# EAGLE board PCB2022-20-02 (EAGLE 9.6.2)
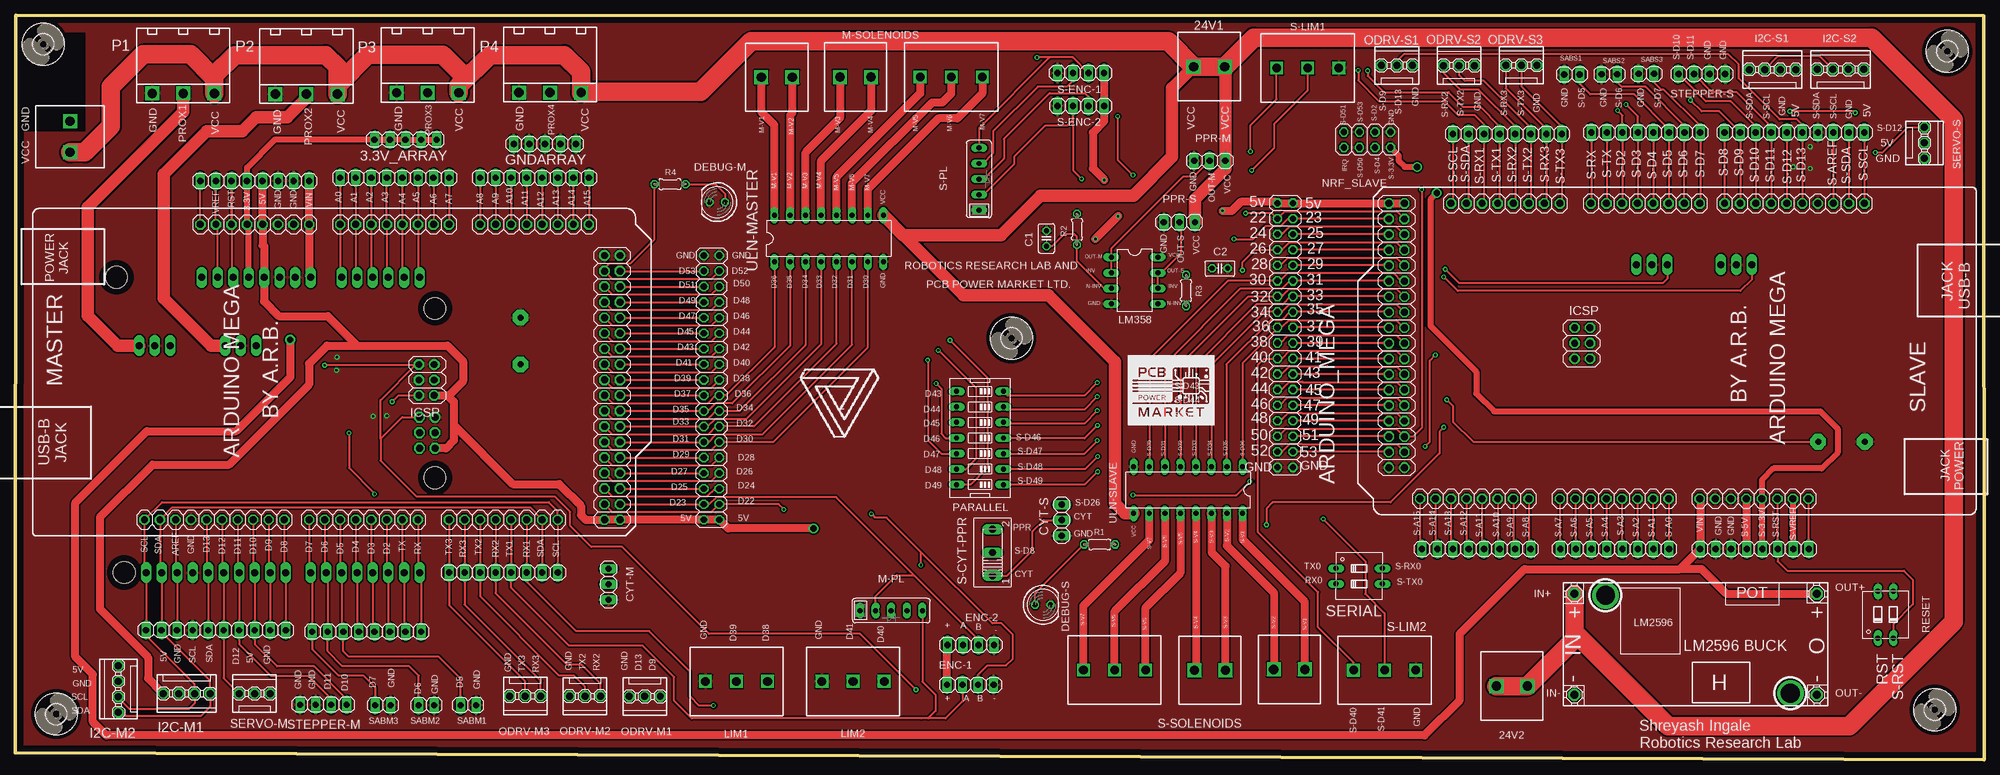
[diagram p5: board, top side]
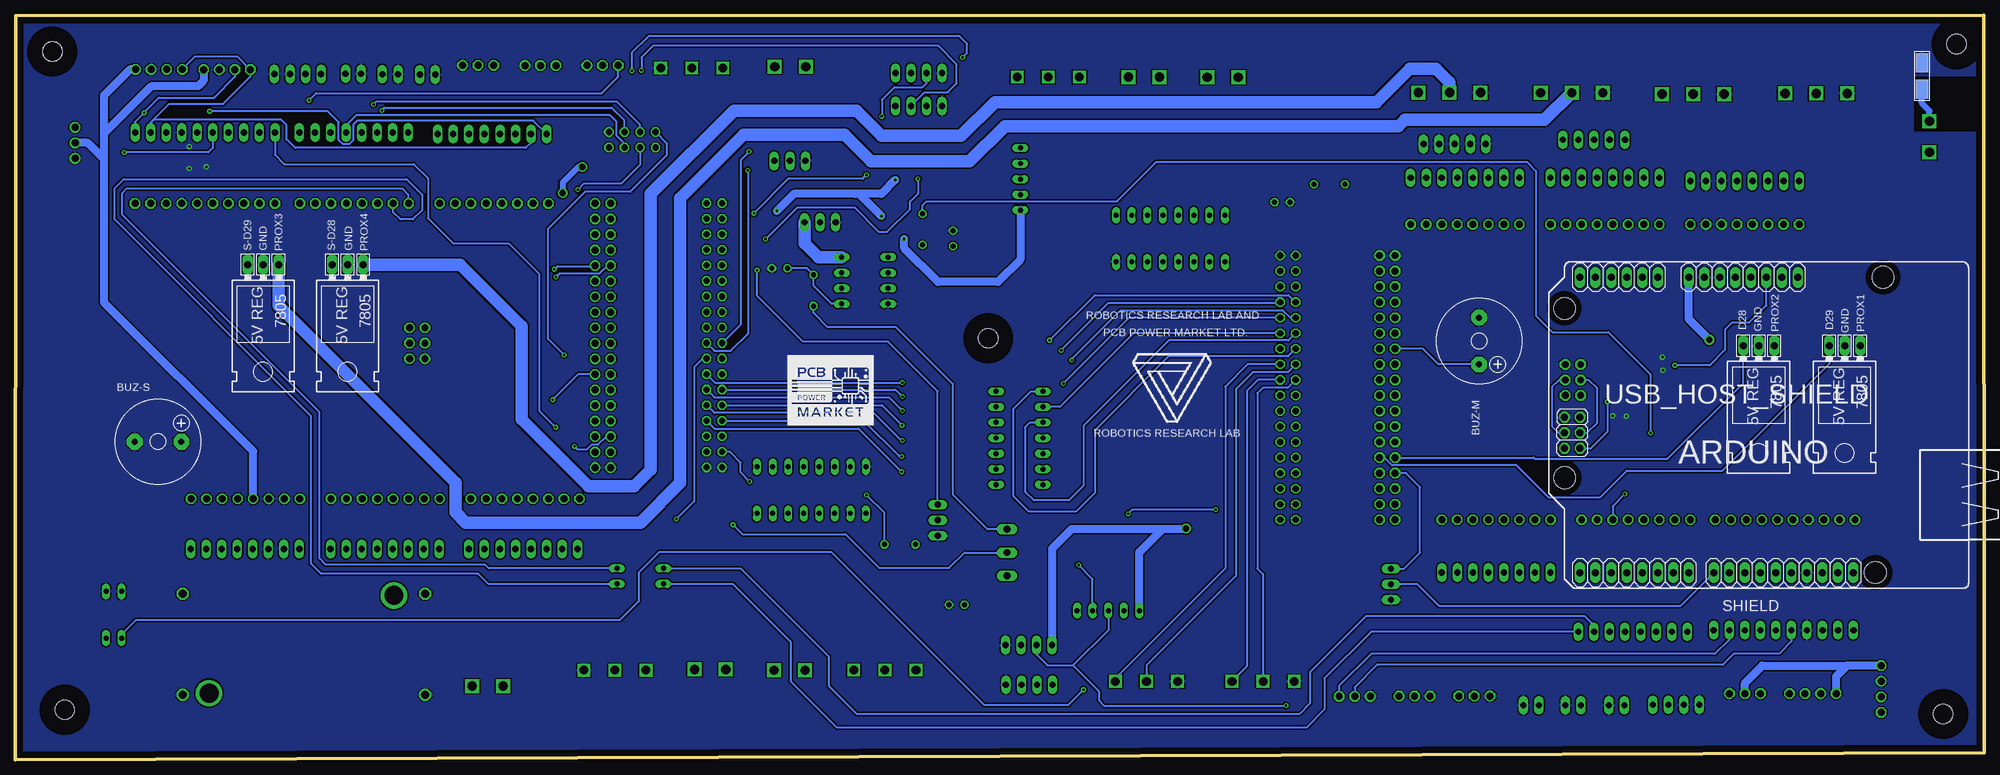
[diagram p6: board, bottom side, seen from below]

Size 321.83 x 121.63 mm. Coordinates in mm from the lower left corner, seen from the top.
Outline: 0,1.08 321.83,0 321.76,121.51 0.05,121.63 0,1.08
Copper layers (1*16): Top 0.035mm / dielectric 1.5mm / Bottom 0.035mm
Design rules "default": minimum track width 6mil, minimum drill 0.35mm, track to track 6mil, track to pad 6mil, pad to pad 6mil, via to via 6mil, smd to smd 6mil, copper to edge 40mil, drill to drill 6mil, minimum pad ring 10mil, minimum via ring 8mil, stop-mask expansion 4mil, vias tented up to drill 0mil, thermal gap 10mil
Net classes: 0 default: width 0.305 mm, drill 0.33 mm, clearance 0.203 mm; 1 arduino master: width 0.305 mm, drill 0.356 mm, clearance 0.254 mm; 2 arduino slave: width 0.305 mm, drill 0.356 mm, clearance 0.254 mm; 3 supply: width 0.305 mm, drill 0.356 mm, clearance 0.254 mm; 4 vin: width 1.016 mm, drill 0.356 mm, clearance 0.305 mm

## Footprints (pad centres in the part's own frame; a part is rotated, then mirrored left to right if it is on the bottom)
1X05 = drill 1.016 long: 1 -5.08,0; 2 -2.54,0; 3 0,0; 4 2.54,0; 5 5.08,0
AB_SCREW_TERMINAL_5MM_2PIN = drill 1.524 square: 1 0,2.54; 2 0,-2.54
F/CM12P = drill 1.016 pad 2.54 octagon: + 3.81,0; - -3.81,0
C025-025X050 = drill 0.813 octagon: 1 -1.27,0; 2 1.27,0
1X03 = drill 1.016 long: 1 -2.54,0; 2 0,0; 3 2.54,0
LED5MM = drill 0.813 octagon: A -1.27,0; K 1.27,0
1X04 = drill 1.016 long: 1 -3.81,0; 2 -1.27,0; 3 1.27,0; 4 3.81,0
3,2 = hole 3.2: 0,0
4PIN_RELIMATE_CONNECTOR = drill 1.143 octagon: 1 0,-3.81; 2 0,-1.27; 3 0,1.27; 4 0,3.81
AB_SCREW_TER_5MM_3PIN = drill 1.397 square: 1 2.54,5.08; 2 2.54,0; 3 2.54,-5.08
DIL08 = drill 0.813 long: 1 -3.81,-3.81; 2 -1.27,-3.81; 3 1.27,-3.81; 4 3.81,-3.81; 5 3.81,3.81; 6 1.27,3.81; 7 -1.27,3.81; 8 -3.81,3.81
1X08 = drill 1.016 long: 1 -8.89,0; 2 -6.35,0; 3 -3.81,0; 4 -1.27,0; 5 1.27,0; 6 3.81,0; 7 6.35,0; 8 8.89,0
1X10 = drill 1.016 long: 1 -11.43,0; 2 -8.89,0; 3 -6.35,0; 4 -3.81,0; 5 -1.27,0; 6 1.27,0; 7 3.81,0; 8 6.35,0; 9 8.89,0; 10 11.43,0
2X18 = drill 1.016 octagon: 1 -21.59,-1.27; 2 -21.59,1.27; 3 -19.05,-1.27; 4 -19.05,1.27; 5 -16.51,-1.27; 6 -16.51,1.27; 7 -13.97,-1.27; 8 -13.97,1.27; 9 -11.43,-1.27; 10 -11.43,1.27; 11 -8.89,-1.27; 12 -8.89,1.27; 13 -6.35,-1.27; 14 -6.35,1.27; 15 -3.81,-1.27; 16 -3.81,1.27; 17 -1.27,-1.27; 18 -1.27,1.27; 19 1.27,-1.27; 20 1.27,1.27; 21 3.81,-1.27; 22 3.81,1.27; 23 6.35,-1.27; 24 6.35,1.27; 25 8.89,-1.27; 26 8.89,1.27; 27 11.43,-1.27; 28 11.43,1.27; 29 13.97,-1.27; 30 13.97,1.27; 31 16.51,-1.27; 32 16.51,1.27; 33 19.05,-1.27; 34 19.05,1.27; 35 21.59,-1.27; 36 21.59,1.27
SIL05A = drill 0.813 long: 1 -5.08,0; 2 -2.54,0; 3 0,0; 4 2.54,0; 5 5.08,0
ARDUINO_MEGA = drill 1.13 octagon: 3V3 24.13,21.59; 5V 24.13,19.05; 5V1 -24.13,-36.83; 5V2 -24.13,-39.37; 5V3 -3.81,-9.017; - 24.13,29.21; A0 24.13,6.35; A1 24.13,3.81; A2 24.13,1.27; A3 24.13,-1.27; A4 24.13,-3.81; A5 24.13,-6.35; A6 24.13,-8.89; A7 24.13,-11.43; A8 24.13,-16.51; A9 24.13,-19.05; A10 24.13,-21.59; A11 24.13,-24.13; A12 24.13,-26.67; A13 24.13,-29.21; A14 24.13,-31.75; A15 24.13,-34.29; AREF -24.13,33.274; D2 -24.13,-1.27; D3 -24.13,1.27; D4 -24.13,3.81; D5 -24.13,6.35; D6 -24.13,8.89; D7 -24.13,11.43; D8 -24.13,15.494; D9 -24.13,18.034; D10 -24.13,20.574; D11 -24.13,23.114; D12 -24.13,25.654; D13 -24.13,28.194; D22 -21.59,-36.83; D23 -21.59,-39.37; D24 -19.05,-36.83; D25 -19.05,-39.37; D26 -16.51,-36.83; D27 -16.51,-39.37; D28 -13.97,-36.83; D29 -13.97,-39.37; D30 -11.43,-36.83; D31 -11.43,-39.37; D32 -8.89,-36.83; D33 -8.89,-39.37; D34 -6.35,-36.83; D35 -6.35,-39.37; D36 -3.81,-36.83; D37 -3.81,-39.37; D38 -1.27,-36.83; D39 -1.27,-39.37; D40 1.27,-36.83; D41 1.27,-39.37; D42 3.81,-36.83; D43 3.81,-39.37; D44 6.35,-36.83; D45 6.35,-39.37; D46 8.89,-36.83; D47 8.89,-39.37; D48 11.43,-36.83; D49 11.43,-39.37; D50 13.97,-36.83; D51 13.97,-39.37; D52 16.51,-36.83; D53 16.51,-39.37; GD3 19.05,-36.83; GD4 19.05,-39.37; GND 24.13,13.97; GND1 24.13,16.51; GND2 -24.13,30.734; GND5 1.245,-9.017; IOREF 24.13,26.67; MISO -3.81,-6.502; MOSI -1.295,-9.017; RST 24.13,24.13; RST1 1.245,-6.502; RX0 -24.13,-6.35; RX1 -24.13,-24.13; RX2 -24.13,-19.05; RX3 -24.13,-13.97; SCK -1.295,-6.502; SCL -24.13,-29.21; SCLU -24.13,38.354; SDA -24.13,-26.67; SDAU -24.13,35.814; TX0 -24.13,-3.81; TX1 -24.13,-21.59; TX2 -24.13,-16.51; TX3 -24.13,-11.43; VIN 24.13,11.43
2X04 = drill 1.016 octagon: 1 -3.81,-1.27; 2 -3.81,1.27; 3 -1.27,-1.27; 4 -1.27,1.27; 5 1.27,-1.27; 6 1.27,1.27; 7 3.81,-1.27; 8 3.81,1.27
3PIN_RELIMATE_CONNECTOR = drill 1.143 octagon: 1 -1.524,-2.54; 2 -1.524,0; 3 -1.524,2.54
AB_RIGHT_TER_BLK_3PIN = drill 1.524 square: 1 -5.588,5.08; 2 -5.588,0; 3 -5.588,-5.08
EDG-07 = drill 0.813 long: 1 -7.62,-3.81; 2 -5.08,-3.81; 3 -2.54,-3.81; 4 0,-3.81; 5 2.54,-3.81; 6 5.08,-3.81; 7 7.62,-3.81; 8 7.62,3.81; 9 5.08,3.81; 10 2.54,3.81; 11 0,3.81; 12 -2.54,3.81; 13 -5.08,3.81; 14 -7.62,3.81
0204/5 = drill 0.813 octagon: 1 -2.54,0; 2 2.54,0
DIP02YL = drill 0.813 long: 1 -1.27,-3.81; 2 1.27,-3.81; 3 1.27,3.81; 4 -1.27,3.81
255SB = drill 1.118 long: 1 -3.81,0; 2 0,0; 3 3.81,0
1X02 = drill 1.016 long: 1 -1.27,0; 2 1.27,0
ARDUINO_USB_HOST_SHIELD = drill 1.143 long: 3V3 1.27,-24.13; 5V1 3.81,-24.13; - -6.35,-24.13; A0 16.51,-24.13; A1 19.05,-24.13; A2 21.59,-24.13; A3 24.13,-24.13; A4 26.67,-24.13; A5 29.21,-24.13; AREF -10.414,24.13; D2 24.13,24.13; D3 21.59,24.13; D4 19.05,24.13; D5 16.51,24.13; D6 13.97,24.13; D7 11.43,24.13; D8 7.366,24.13; D9 4.826,24.13; D10 2.286,24.13; D11 -0.254,24.13; D12 -2.794,24.13; D13 -5.334,24.13; GND -7.874,24.13; GND2 8.89,-24.13; GND3 6.35,-24.13; RST1 -1.27,-24.13; RX0 29.21,24.13; SCL -15.494,24.13; SDA -12.954,24.13; TX0 26.67,24.13; VIN 11.43,-24.13; VREF -3.81,-24.13 | drill 1.168 octagon: 5V 31.75,3.81; GND1 31.75,-1.27; MISO 29.21,3.81; MOSI 31.75,1.27; RST 29.21,-1.27; SCK 29.21,1.27 | hole 3.56: 31.75,-19.05; 31.75,8.636; -19.05,24.13; -20.32,-24.13
AB_JUMPER_ONE_WAY = smd 3.048 x 2.032: 1 -2.286,0; 2 2.032,0
LM2596_BUCK_CONVERTER = drill 1.27 octagon: IN+ -19.304,6.35; IN- -19.304,-10.16; OUT+ 20.32,6.35; OUT- 20.32,-10.16 | drill 3.048 pad 4.318: P$1 -14.224,6.096; P$2 16.002,-9.906
AB_7805_FLAT = drill 1.143 long: 1 -7.874,1.778; 2 -7.874,-0.762; 3 -7.874,-3.302
DIL16 = drill 0.813 long: 1 -8.89,-3.81; 2 -6.35,-3.81; 3 -3.81,-3.81; 4 -1.27,-3.81; 5 1.27,-3.81; 6 3.81,-3.81; 7 6.35,-3.81; 8 8.89,-3.81; 9 8.89,3.81; 10 6.35,3.81; 11 3.81,3.81; 12 1.27,3.81; 13 -1.27,3.81; 14 -3.81,3.81; 15 -6.35,3.81; 16 -8.89,3.81

## Placement (x,y rotation side)
3.3V_ARRAY  [1X05]  63.78,101.3 180 top
24V1  AB_SCREW_TERMINAL_5MM_2PIN  [AB_SCREW_TERMINAL_5MM_2PIN]  195.15,113.23 270 top
24V2  AB_SCREW_TERMINAL_5MM_2PIN  [AB_SCREW_TERMINAL_5MM_2PIN]  244.63,12.01 90 top
BUZ-M  F/CM12P  [F/CM12P]  82.58,68.4 270 bottom
BUZ-S  F/CM12P  [F/CM12P]  298.5,51.94 0 bottom
C1  [C025-025X050]  168.55,85.17 90 top
C2  [C025-025X050]  196.9,80.26 0 top
CYT-M  [1X03]  96.98,28.65 90 top
CYT-S  [1X03]  171.06,39.14 90 top
DEBUG-M  [LED5MM]  114.73,91.11 180 top
DEBUG-S  [LED5MM]  167.97,25.3 0 top
ENC-1  [1X04]  156.11,12.22 0 top
ENC-2  [1X04]  156.18,18.72 0 top
GNDARRAY  [1X05]  86.56,100.61 180 top
H2  MOUNT-HOLE3.2  [3,2]  6.71,7.44 0 top
H3  MOUNT-HOLE3.2  [3,2]  313.74,8.15 0 top
H4  MOUNT-HOLE3.2  [3,2]  315.77,115.72 0 top
H5  MOUNT-HOLE3.2  [3,2]  4.55,116.92 0 top
H6  MOUNT-HOLE3.2  [3,2]  162.81,68.86 0 top
I2C-M1  4PIN_RELIMATE_CONNECTOR  [4PIN_RELIMATE_CONNECTOR]  28.02,10.79 90 top
I2C-M2  4PIN_RELIMATE_CONNECTOR  [4PIN_RELIMATE_CONNECTOR]  16.84,11.53 0 top
I2C-S1  4PIN_RELIMATE_CONNECTOR  [4PIN_RELIMATE_CONNECTOR]  287.22,112.75 270 top
I2C-S2  4PIN_RELIMATE_CONNECTOR  [4PIN_RELIMATE_CONNECTOR]  298.35,112.78 270 top
LIM1  AB_SCREW_TER_5MM_3PIN  [AB_SCREW_TER_5MM_3PIN]  117.88,15.32 270 top
LIM2  AB_SCREW_TER_5MM_3PIN  [AB_SCREW_TER_5MM_3PIN]  136.93,15.32 270 top
LM358  [DIL08]  182.96,78.28 270 top
M1  [1X08]  39.14,94.56 0 top
M2  [1X08]  62,95.07 0 top
M3  [1X08]  84.86,95.07 0 top
M4  [1X10]  32.79,21.16 180 top
M5  [1X08]  57.43,20.9 0 top
M6  [1X08]  79.78,30.56 0 top
M7  [2X18]  113.82,60.78 90 top
M-PL  D5-1A  [SIL05A]  143.18,24.36 0 top
M-SOLENOID1  AB_SCREW_TERMINAL_5MM_2PIN  [AB_SCREW_TERMINAL_5MM_2PIN]  124.46,111.51 270 top
M-SOLENOID2  AB_SCREW_TERMINAL_5MM_2PIN  [AB_SCREW_TERMINAL_5MM_2PIN]  137.34,111.53 270 top
M-SOLENOIDS  AB_SCREW_TER_5MM_3PIN  [AB_SCREW_TER_5MM_3PIN]  152.98,114.07 270 top
MASTER  ARDUINO_MEGA  [ARDUINO_MEGA]  59.46,63.32 90 top
NRF_SLAVE  [2X04]  220.98,101.3 180 top
ODRV-M1  3PIN_RELIMATE_CONNECTOR  [3PIN_RELIMATE_CONNECTOR]  102.9,11.84 90 top
ODRV-M2  3PIN_RELIMATE_CONNECTOR  [3PIN_RELIMATE_CONNECTOR]  93.12,11.89 90 top
ODRV-M3  3PIN_RELIMATE_CONNECTOR  [3PIN_RELIMATE_CONNECTOR]  83.34,11.91 90 top
ODRV-S1  3PIN_RELIMATE_CONNECTOR  [3PIN_RELIMATE_CONNECTOR]  225.83,111.91 270 top
ODRV-S2  3PIN_RELIMATE_CONNECTOR  [3PIN_RELIMATE_CONNECTOR]  235.99,111.89 270 top
ODRV-S3  3PIN_RELIMATE_CONNECTOR  [3PIN_RELIMATE_CONNECTOR]  246.18,111.94 270 top
P1  AB_RIGHT_TER_BLK_3PIN  [AB_RIGHT_TER_BLK_3PIN]  27.46,114.45 90 top
P2  AB_RIGHT_TER_BLK_3PIN  [AB_RIGHT_TER_BLK_3PIN]  47.57,114.35 90 top
P3  AB_RIGHT_TER_BLK_3PIN  [AB_RIGHT_TER_BLK_3PIN]  67.41,114.55 90 top
P4  AB_RIGHT_TER_BLK_3PIN  [AB_RIGHT_TER_BLK_3PIN]  87.4,114.58 90 top
PARALLEL  [EDG-07]  157.68,52.55 90 top
PPR-M  [1X03]  195.22,97.84 0 top
PPR-S  [1X03]  190.27,87.81 180 top
R1  [0204/5]  177.24,35.15 0 top
R2  [0204/5]  173.53,86.64 90 top
R3  [0204/5]  191.36,76.66 90 top
R4  [0204/5]  107.01,94.03 180 top
RESET  [DIP02YL]  305.71,23.67 0 top
S1  [1X10]  290.81,102.49 0 top
S2  [1X08]  266.5,102.49 0 top
S3  [1X08]  243.89,102.24 0 top
S4  [2X18]  207.57,69.34 270 top
S5  [1X08]  238.81,34.42 180 top
S6  [1X08]  261.42,34.42 180 top
S7  [1X08]  284.28,34.42 180 top
S-CYT-PPR  [255SB]  159.73,33.83 90 top
S-ENC-1  [1X04]  174.14,112.19 180 top
S-ENC-2  [1X04]  174.17,106.81 180 top
S-LIM1  AB_SCREW_TER_5MM_3PIN  [AB_SCREW_TER_5MM_3PIN]  211.25,110.49 90 top
S-LIM2  AB_SCREW_TER_5MM_3PIN  [AB_SCREW_TER_5MM_3PIN]  223.82,12.06 90 top
S-PL  D5-1A  [SIL05A]  157.53,94.87 90 top
S-SOLENOID1  AB_SCREW_TERMINAL_5MM_2PIN  [AB_SCREW_TERMINAL_5MM_2PIN]  208.25,14.73 90 top
S-SOLENOID2  AB_SCREW_TERMINAL_5MM_2PIN  [AB_SCREW_TERMINAL_5MM_2PIN]  195.28,14.61 90 top
S-SOLENOIDS  AB_SCREW_TER_5MM_3PIN  [AB_SCREW_TER_5MM_3PIN]  179.68,12.09 90 top
SABM1  [1X02]  74.04,8.89 180 top
SABM2  [1X02]  67.21,8.89 180 top
SABM3  [1X02]  60.1,8.89 180 top
SABS1  [1X02]  254.43,111.94 0 top
SABS2  [1X02]  260.55,111.99 0 top
SABS3  [1X02]  266.6,112.06 0 top
SERIAL  [DIP02YL]  219.68,29.97 270 top
SERVO-M  3PIN_RELIMATE_CONNECTOR  [3PIN_RELIMATE_CONNECTOR]  39.12,9.27 270 top
SERVO-S  3PIN_RELIMATE_CONNECTOR  [3PIN_RELIMATE_CONNECTOR]  310.54,100.79 180 top
SHIELD  ARDUINO_USB_HOST_SHIELD  [ARDUINO_USB_HOST_SHIELD]  36.86,54.69 180 bottom
SLAVE  ARDUINO_MEGA  [ARDUINO_MEGA]  263.89,66.75 270 top
STEPPER-M  [1X04]  50.37,8.97 180 top
STEPPER-S  [1X04]  275.67,112.04 0 top
U$2  AB_JUMPER_ONE_WAY  [AB_JUMPER_ONE_WAY]  10.19,111.84 90 bottom
U$3  LM2596_BUCK_CONVERTER  [LM2596_BUCK_CONVERTER]  274.14,20.75 0 top
U$10  AB_7805_FLAT  [AB_7805_FLAT]  22.06,59.77 270 bottom
U$11  AB_7805_FLAT  [AB_7805_FLAT]  36.11,59.77 270 bottom
U$12  AB_7805_FLAT  [AB_7805_FLAT]  266.75,73.03 270 bottom
U$13  AB_7805_FLAT  [AB_7805_FLAT]  280.56,73.03 270 bottom
ULN-MASTER  [DIL16]  132.99,85.14 0 top
ULN-SLAVE  [DIL16]  191.69,44.04 180 top
VCC  AB_SCREW_TERMINAL_5MM_2PIN  [AB_SCREW_TERMINAL_5MM_2PIN]  8.94,101.78 180 top

## Tracks (layer width: path | path; a pad name or v marks a point on that pad's centre or on a via)
3V3A
  Top 1.016: MASTER.3V3 37.87,87.53 | 37.87,87.53 M1.4 37.87,96.75 42.42,101.3 3.3V_ARRAY.3 | 3.3V_ARRAY.5 3.3V_ARRAY.4 3.3V_ARRAY.3 | 3.3V_ARRAY.3 3.3V_ARRAY.2 3.3V_ARRAY.1 | SHIELD.3V3 38.13,87.27 37.87,87.53
5VA  (via drill 1.04)
  Top 0.305: 152.3,18.64 ENC-2.1
  Top 1.27: M1.5 MASTER.5V 40.41,84.02 40.67,84.02 SHIELD.5V1 40.67,74.88 43.08,72.47 51.08,72.47 55.91,67.64 | MASTER.5V1 96.32,39.17 115.09,39.17 M7.1 | MASTER.5V3 70.64,59.51 70.76,59.39 | 70.76,59.39 71.65,58.5 71.65,54.69 | 71.65,54.69 71.65,52.15 70.38,50.88 SHIELD.5V | 71.65,54.69 81.31,45.03 88.93,45.03 92.48,41.48 92.48,39.95 93.24,39.19 MASTER.5V1 | 55.91,67.64 50.95,67.64 48.03,64.72 48.03,61.29 34.95,48.21 22.45,48.21 13.82,39.57 13.82,24.61 21.72,16.71 21.72,13.28 I2C-M1.4 | 55.91,67.64 70.64,67.64 73.18,65.1 73.18,61.8 70.76,59.39 | M7.1 116.51,37.77 v130.48,37.77 | M7.1 M7.2 | MASTER.5V2 MASTER.5V1 | ENC-1.1 152.3,18.64
  Bottom 1.27: 134.26,37.72 149.12,37.72 152.37,34.47 152.37,32.89 ENC-2.1 | 134.26,37.72 130.53,37.72 v130.48,37.77 | SERVO-M.2 39.12,12.5 36.27,15.34 22.45,15.34 | I2C-M1.4 24.23,10.82 24.23,13.56 22.45,15.34 | I2C-M2.4 22.45,15.34 | M-PL.1 138.1,33.88 134.26,37.72
A0
  Top 0.305: M2.1 MASTER.A0 53.11,79.07 SHIELD.A0
A1
  Top 0.305: M2.2 MASTER.A1 55.65,79.07 SHIELD.A1
A2
  Top 0.305: M2.3 MASTER.A2 58.19,79.07 SHIELD.A2
A3
  Top 0.305: SHIELD.A3 60.73,79.07 MASTER.A3 M2.4
A4
  Top 0.305: M2.5 MASTER.A4 63.27,79.07 SHIELD.A4
A5
  Top 0.305: M2.6 MASTER.A5 65.81,79.07 SHIELD.A5
A6
  Top 0.305: M2.7 MASTER.A6
A7
  Top 0.305: M2.8 MASTER.A7
A8
  Top 0.305: M3.1 MASTER.A8
A9
  Top 0.305: M3.2 MASTER.A9
A10
  Top 0.305: M3.3 MASTER.A10
A11
  Top 0.305: M3.4 MASTER.A11
A12
  Top 0.305: M3.5 MASTER.A12
A13
  Top 0.305: M3.6 MASTER.A13
A14
  Top 0.305: M3.7 MASTER.A14
A15
  Top 0.305: M3.8 MASTER.A15
AREF
  Top 0.305: MASTER.AREF 26.19,30.81 SHIELD.AREF M4.8
CYT
  Top 0.305: S-CYT-PPR.1 162.07,30.02 166.27,34.22 166.27,37.3 168.11,39.14 CYT-S.2
D2  (via drill 0.36)
  Top 0.305: MASTER.D2 60.73,30.81 SHIELD.D2 60.99,21.16 M5.6 | v54.53,53.37 54.53,47.65 58.72,43.46 v58.72,43.41
  Bottom 0.305: R2.2 173.53,90.55 172.87,91.21 141.73,91.21 135.28,97.66 74.78,97.66 73.28,96.16 73.28,72.52 70.61,69.85 61.42,69.85 54.53,62.97 v54.53,53.37 | v58.72,43.41 60.73,41.4 MASTER.D2
D3
  Top 0.305: MASTER.D3 58.19,30.81 SHIELD.D3 58.45,21.16 M5.5
D4
  Top 0.305: MASTER.D4 55.65,30.81 SHIELD.D4 55.91,21.16 M5.4
D5
  Top 0.305: MASTER.D5 53.11,30.81 SHIELD.D5 53.37,21.16 M5.3 53.62,17.73 54.51,16.84 69.16,16.84 72.77,13.23 SABM1.2
D6
  Top 0.305: MASTER.D6 50.57,30.81 SHIELD.D6 51.08,30.3 M5.2 51.08,17.68 53.47,15.29 64.36,15.29 65.94,13.72 SABM2.2
D7
  Top 0.305: MASTER.D7 48.03,30.81 SHIELD.D7 48.54,30.3 M5.1 48.54,18.01 52.79,13.75 56.86,13.75 58.83,11.79 SABM3.2
D8
  Top 0.305: MASTER.D8 43.97,30.81 SHIELD.D8 M4.1
  Bottom 0.305: SHIELD.D8 49.68,25.1 89.05,25.1 92.61,28.65 CYT-M.2
D9
  Top 0.305: MASTER.D9 41.43,30.81 SHIELD.D9 M4.2
  Bottom 0.305: M4.2 41.68,19.61 44.02,17.27 100.2,17.27 105.44,12.04 ODRV-M1.1
D10
  Top 0.305: MASTER.D10 38.89,30.81 SHIELD.D10 M4.3 39.14,18.87 42.8,15.21 48.84,15.21 54.18,9.88 STEPPER-M.1
D11
  Top 0.305: MASTER.D11 36.35,30.81 SHIELD.D11 M4.4 36.6,18.87 41.83,13.64 47.98,13.64 51.64,9.98 STEPPER-M.2
D12
  Top 0.305: MASTER.D12 33.81,30.81 SHIELD.D12 M4.5 34.06,13.31 SERVO-M.1
D13
  Top 0.305: MASTER.D13 31.27,30.81 SHIELD.D13 M4.6
  Bottom 0.305: M4.6 31.52,19.3 33.5,17.32 40.89,17.32 42.72,15.49 99.26,15.49 102.9,11.86 ODRV-M1.2
D22  (via drill 0.36)
  Top 0.305: MASTER.D22 97.55,40.48 113.83,40.48 M7.3 124.76,41.73 v125.63,40.87 | ENC-1.3 157.38,13.89 158.88,15.39 161.95,15.39 163.04,16.48 163.04,20.42 161.21,22.25 159.69,22.25 148.03,33.91 | v139.93,40.16 140.56,39.52 142.42,39.52 147.82,34.13 148.03,33.91 | v148.03,31.8 148.03,33.91
  Bottom 0.305: v139.93,40.16 139.19,40.89 125.65,40.89 v125.63,40.87 | M-PL.4 145.72,29.49 v148.03,31.8
D23
  Top 0.305: MASTER.D23 M7.4 113.44,41.73 114.6,42.9 134.16,42.9 146.9,30.16 | ENC-2.3 157.45,19.61 146.9,30.16 | M-PL.2 140.64,26.72 144.08,30.16 146.9,30.16
D24
  Top 0.305: MASTER.D24 97.56,43 113.11,43 114.38,44.27 M7.5
D25
  Top 0.305: MASTER.D25 M7.6
D26
  Top 0.305: MASTER.D26 97.56,45.54 113.82,45.54 M7.7
  Bottom 0.305: CYT-M.3 94.84,31.19 92.23,33.81 92.23,44.53 94.51,46.81 MASTER.D26
D27
  Top 0.305: MASTER.D27 M7.8
D28
  Top 0.305: MASTER.D28 97.56,48.08 113.82,48.08 M7.9
  Bottom 0.305: MASTER.D28 73.63,49.35 73.46,49.17 51.77,49.17 39.41,61.53 U$11.3
D29
  Top 0.305: MASTER.D29 M7.10
  Bottom 0.305: U$10.3 25.36,64.66 42.8,47.22 58.42,47.22 62.77,42.87 71.22,42.87 76.45,48.1 96.81,48.1 98.07,49.35 MASTER.D29
D30
  Top 0.305: MASTER.D30 97.56,50.62 113.82,50.62 M7.11 123.88,51.89 139.34,67.36 ULN-MASTER.7
D31
  Top 0.305: MASTER.D31 M7.12 113.31,51.89 114.5,53.09 122.1,53.09 136.8,67.79 ULN-MASTER.6
D32
  Top 0.305: MASTER.D32 97.56,53.16 113.31,53.16 114.58,54.43 M7.13 120.73,54.43 134.26,67.97 ULN-MASTER.5
D33
  Top 0.305: MASTER.D33 M7.14 113.16,54.43 114.35,55.63 119.45,55.63 131.72,67.89 ULN-MASTER.4
D34
  Top 0.305: MASTER.D34 97.56,55.7 113.26,55.7 114.53,56.97 M7.15 118.41,56.97 129.16,67.72 129.16,81.31 ULN-MASTER.3
D35
  Top 0.305: MASTER.D35 M7.16 113.21,56.97 114.43,58.19 117.17,58.19 126.64,67.67 ULN-MASTER.2
D36
  Top 0.305: MASTER.D36 96.37,59.51 97.64,58.24 113.23,58.24 114.5,59.51 M7.17 116.21,59.51 124.1,67.41 ULN-MASTER.1
D37
  Top 0.305: MASTER.D37 M7.18
D38
  Top 0.305: MASTER.D38 97.56,60.78 113.82,60.78 M7.19
  Bottom 0.305: M7.19 118.72,62.05 120.52,60.25 120.52,15.21 LIM1.1
D39
  Top 0.305: MASTER.D39 M7.20
  Bottom 0.305: M7.20 113.84,60.76 117.93,60.76 118.8,59.89 118.8,31.22 117.88,30.3 LIM1.2
D40
  Top 0.305: MASTER.D40 97.56,63.32 113.82,63.32 M7.21
  Bottom 0.305: M7.21 120.4,64.59 124.05,60.93 124.05,31.27 142.01,13.31 LIM2.1
D41
  Top 0.305: MASTER.D41 M7.22
  Bottom 0.305: M7.22 113.82,63.32 119.53,63.32 122.3,60.55 122.3,30.02 136.93,15.39 LIM2.2
D42
  Top 0.305: MASTER.D42 97.55,65.88 113.83,65.88 M7.23
  Bottom 0.305: BUZ-M.+ 89.18,64.59 91.72,67.13 MASTER.D42
D43
  Top 0.305: MASTER.D43 M7.24
  Bottom 0.305: M7.24 113.79,65.89 133.32,65.89 145.36,53.85 145.36,43.59 148.43,40.53 156.12,40.53 158.65,43.05 158.65,57.33 155.8,60.17 PARALLEL.8
D44
  Top 0.305: MASTER.D44 97.56,68.4 113.82,68.4 M7.25
  Bottom 0.305: M7.25 139.07,69.67 151.1,57.63 PARALLEL.9
D45
  Top 0.305: MASTER.D45 M7.26
  Bottom 0.305: M7.26 113.71,68.5 133.25,68.5 147.22,54.53 147.22,44.76 149.61,42.37 155.32,42.37 156.67,43.71 156.67,54.36 155.93,55.09 PARALLEL.10
D46  (via drill 0.36)
  Top 0.305: MASTER.D46 97.56,70.94 113.82,70.94 M7.27 | v150.52,61.47 151.36,60.63 151.36,53.26 152.07,52.55 PARALLEL.11
  Bottom 0.305: M7.27 139.78,72.21 v150.52,61.47
D47  (via drill 0.36)
  Top 0.305: MASTER.D47 M7.28 | v149.12,65.28 149.2,65.2 149.2,52.2 151.38,50.01 PARALLEL.12
  Bottom 0.305: M7.28 113.44,72.21 114.6,73.38 141.22,73.38 149.12,65.48 v149.12,65.28
D48  (via drill 0.36)
  Top 0.305: MASTER.D48 97.56,73.48 113.82,73.48 M7.29 | PARALLEL.13 155.37,47.47 157.02,49.12 157.02,60.78 150.93,66.88 v150.88,66.88
  Bottom 0.305: v150.88,66.88 143.1,74.65 115.19,74.65 M7.29
D49  (via drill 0.36)
  Top 0.305: MASTER.D49 M7.30 | v152.78,68.53 158.93,62.38 158.93,47.75 156.11,44.93 PARALLEL.14
  Bottom 0.305: v152.78,68.53 145.39,75.92 113.72,75.92 M7.30
D50
  Top 0.305: MASTER.D50 97.55,76.04 113.83,76.04 M7.31
D51
  Top 0.305: MASTER.D51 M7.32
D52
  Top 0.305: M7.33 113.82,78.56 97.56,78.56 MASTER.D52 96.29,80.21 97.18,81.1 100.53,81.1 104.47,85.04 R4.2
D53
  Top 0.305: MASTER.D53 M7.34
GND  (via drill 0.4)
  other vias: 52.58,65.76 52.5,63.63 60.73,56.18 58.5,56.11 293.4,100.15 293.4,96.6 290.6,96.85
  pour Bottom: 0.03,1.35 0.03,102.44 11.71,102.44 11.71,111.84 0.03,111.84 0.03,121.23 321.34,121.23 321.34,1.35
  pour Top: 0.03,1.35 0.03,102.44 11.71,102.44 11.71,119.02 0.03,119.02 0.03,121.23 321.34,121.23 321.34,1.35
GND-A
  Bottom 1.016: VCC.2 8.94,106.02 10.19,107.26 U$2.1
M-V1
  Top 1.27: M-SOLENOID1.2 121.92,105.87 124.1,103.68 ULN-MASTER.16
M-V2
  Top 1.27: M-SOLENOID1.1 127,105.69 126.64,105.33 ULN-MASTER.15
M-V3
  Top 1.27: M-SOLENOID2.2 134.8,104.85 129.18,99.24 ULN-MASTER.14
M-V4
  Top 1.27: M-SOLENOID2.1 139.88,106.02 131.72,97.87 ULN-MASTER.13
M-V5
  Top 1.27: M-SOLENOIDS.3 147.9,108.86 134.26,95.22 ULN-MASTER.12
M-V6
  Top 1.27: M-SOLENOIDS.2 152.98,108.84 151.51,107.37 149.86,107.37 136.8,94.31 ULN-MASTER.11
M-V7
  Top 1.27: M-SOLENOIDS.1 158.06,108.86 154,104.8 150.9,104.8 139.34,93.24 ULN-MASTER.10
MISO  (via drill 0.35)
  Top 0.305: v61.6,58.47 62.64,59.51 MASTER.MISO
  Bottom 0.305: SHIELD.MISO 64.29,50.88 61.57,53.59 61.57,58.45 v61.6,58.47
MOSI
  Bottom 0.305: MASTER.MOSI 69.52,62.03 70.64,60.91 70.64,54.43 69.62,53.42 SHIELD.MOSI
N$1
  Top 0.305: C1.1 169.47,83.9 171.4,85.83 173.13,85.83 173.53,85.42 R2.1 173.53,81.43 177.95,77.01 LM358.3
N$2
  Top 0.305: DEBUG-S.A 166.7,27.15 R1.1
N$5
  Bottom 0.305: C2.1 192.43,80.26 R3.2 191.36,77.44 188.39,74.47 LM358.5
N$8
  Top 0.305: R4.1 114.45,94.03 116,92.48 DEBUG-M.A
N$18
  Top 0.305: MASTER.- M1.1
N$19
  Top 0.305: SLAVE.- 293.1,34.48 S7.1
OUT-M
  Top 0.305: LM358.2 LM358.1 179.15,83.54 190.83,95.22 192.61,95.22 PPR-M.2
OUT-S
  Top 0.305: LM358.6 LM358.7 187.33,79.55 190.53,82.75 190.53,87.55 PPR-S.2
PPR
  Bottom 0.305: S-CYT-PPR.3 162.92,37.64 168.53,43.25 168.53,61.34 177.87,70.68 189.05,70.68 191.36,73 R3.1
PROX1
  Top 2.032: P1.2 27.43,108.84 27.43,105.89 11.84,90.3 11.84,72.53 16.72,67.64 U$10.1
PROX2
  Top 2.032: U$11.1 32.03,67.64 24.28,75.39 24.28,95.63 31.32,102.67 37.08,102.67 39.4,104.98 44.48,104.98 47.57,108.08 P2.2
PROX3
  Bottom 2.032: P3.2 71.86,104.52 94.69,104.52 95.73,103.48 160.1,103.48 165.84,97.74 181.91,97.74 186.26,102.08 202.77,102.08 213.16,91.69 213.16,45.21 219.63,38.74 248.21,38.74 249.86,40.39 249.86,45.21 278.78,74.14 U$13.1
PROX4
  Bottom 2.032: P4.2 87.4,110.69 89.64,112.93 93.85,112.93 99.36,107.42 161.7,107.42 167.21,101.91 180.21,101.91 184.35,106.05 204.37,106.05 217.98,92.43 217.98,47.37 220.65,44.7 228.14,44.7 239.06,55.63 239.06,70.84 249.12,80.9 U$12.1
RST  (via drill 0.36)
  Top 0.305: 59.72,52.4 59.72,48.84 65.56,43 88.16,43 90.7,40.46 90.7,38.18 94.13,34.75 99.19,34.75 113.39,20.55 138.07,20.55 v147.22,11.4 | 59.72,52.4 63.27,55.96 SHIELD.RST | 59.72,52.4 59.72,58.73 65.56,64.57 MASTER.RST1 65.84,64.44 v50.57,64.44 | SHIELD.RST1 35.33,79.07 M1.3 MASTER.RST
  Bottom 0.305: SHIELD.RST1 35.59,74.24 38.38,71.45 41.17,71.45 42.37,70.26 42.37,66.95 44.88,64.44 v50.57,64.44 | v147.22,11.4 149.68,8.94 163.45,8.94 188.47,33.96 216.51,33.96 219.94,30.53 219.94,25.86 223.01,22.78 302.11,22.78 304.44,20.45 RESET.1
RX0
  Top 0.305: MASTER.RX0 65.81,30.81 SHIELD.RX0 66.32,30.3 M5.8
  Bottom 0.305: SERIAL.2 204.55,28.7 195.07,19.23 195.07,12.78 187.53,5.23 110.82,5.23 107.85,8.2 107.85,13.26 100.2,20.9 M5.8
RX1  (via drill 0.36)
  Top 0.305: MASTER.RX1 M6.6 83.59,29.06 91.64,21.01 103.63,21.01 110.26,14.38 110.26,10.36 111.79,8.84 v114.12,8.84
  Bottom 0.305: ENC-2.2 154.91,17.2 153.11,15.39 148.97,15.39 | 148.97,15.39 148.92,15.39 143.18,21.13 M-PL.3 | 148.97,15.39 144.73,11.15 144.73,9.7 143.87,8.84 v114.12,8.84
RX2
  Top 0.305: MASTER.RX2 M6.4 78.51,27.2 90.22,15.49 92.53,15.49 95.66,12.37 ODRV-M2.1
RX3
  Top 0.305: MASTER.RX3 M6.2 73.43,25.32 85.88,12.88 ODRV-M3.1
S-3V3  (via drill 1.04)
  Top 1.016: v232.36,92.61 231.32,91.57 231.32,70.87 238.81,63.37 238.81,59.82 241.73,56.9 295.07,56.9 297.87,54.1 297.87,50.17 295.27,47.58 287.39,47.58 285.48,45.67 SLAVE.3V3 285.55,42.56 S7.4 | NRF_SLAVE.2 226.09,98.73 226.09,97.87 227.1,96.85 v229.13,96.85
  Bottom 1.016: v232.36,92.61 232.33,92.63 232.33,94.29 229.77,96.85 v229.13,96.85
S-5V  (via drill 0.36)
  Top 0.305: S-ENC-2.1 177.95,106.78 | v176.56,85.06 176.56,85.09
  Top 1.016: 224.47,90.93 SLAVE.5V2
  Top 1.27: SLAVE.5V2 SLAVE.5V1 | 224.47,90.93 S4.2 S4.1 206.1,91.14 200.3,91.14 198.86,89.69 v197.33,89.69 | S-ENC-1.1 177.95,106.78 | S-ENC-2.1 177.98,104.32 176.12,102.46 176.12,96.6 v178,94.72 | v180.26,88.8 176.56,85.09
  Bottom 0.305: v180.26,88.8 180.26,88.83
  Bottom 1.27: v178,94.72 180.26,92.46 184.62,92.46 | v197.33,89.69 194.56,92.46 184.62,92.46 | S-PL.1 157.53,81.69 161.16,78.05 171.04,78.05 176.56,83.57 v176.56,85.06 | 180.26,88.83 183.89,92.46 184.62,92.46
S-5VA
  Top 1.27: SLAVE.5V 282.98,42.58 282.98,34.44 S7.5
  Bottom 1.27: SLAVE.5V 282.94,50.37 307.34,74.77 307.34,98.16 | I2C-S2.4 303.05,112.78 307.34,108.48 307.34,102.26 | 307.34,102.26 299.49,110.11 291.87,110.11 291.03,110.95 I2C-S1.4 | 307.34,102.26 307.34,98.16 | 307.34,98.16 309.97,100.79 SERVO-S.2
S-A0
  Top 0.305: SLAVE.A0 270.24,34.48 S6.1
S-A1
  Top 0.305: SLAVE.A1 267.7,34.48 S6.2
S-A2
  Top 0.305: SLAVE.A2 265.16,34.48 S6.3
S-A3
  Top 0.305: SLAVE.A3 262.62,34.48 S6.4
S-A4
  Top 0.305: SLAVE.A4 260.08,34.48 S6.5
S-A5
  Top 0.305: SLAVE.A5 257.54,34.48 S6.6
S-A6
  Top 0.305: SLAVE.A6 255,34.48 S6.7
S-A7
  Top 0.305: SLAVE.A7 252.46,34.48 S6.8
S-A8
  Top 0.305: SLAVE.A8 247.38,34.74 S5.1
S-A9
  Top 0.305: SLAVE.A9 244.84,34.74 S5.2
S-A10
  Top 0.305: SLAVE.A10 242.3,34.74 S5.3
S-A11
  Top 0.305: SLAVE.A11 239.76,34.74 S5.4
S-A12
  Top 0.305: SLAVE.A12 237.22,34.74 S5.5
S-A13
  Top 0.305: SLAVE.A13 234.68,34.74 S5.6
S-A14
  Top 0.305: SLAVE.A14 232.14,34.74 S5.7
S-A15
  Top 0.305: SLAVE.A15 229.6,34.74 S5.8
S-AREF
  Top 0.305: S1.8 SLAVE.AREF
S-D2  (via drill 0.36)
  Top 0.305: SLAVE.D2 262.69,90.95 S2.3 262.69,105.28 v261.9,106.07
  Bottom 0.305: NRF_SLAVE.3 222.25,104.47 224.33,106.55 261.42,106.55 v261.9,106.07
S-D3  (via drill 0.36)
  Top 0.305: SLAVE.D3 265.23,90.95 S2.4 265.23,105.11 v263.27,107.06
  Bottom 0.305: NRF_SLAVE.5 219.71,103.71 223.57,107.57 262.76,107.57 v263.27,107.06
S-D4
  Top 0.305: S2.5 267.77,90.95 SLAVE.D4
  Bottom 0.305: NRF_SLAVE.4 222.25,100.66 223.57,101.98 223.57,104.27 224.59,105.28 266.14,105.28 267.77,103.66 S2.5
S-D5
  Top 0.305: SLAVE.D5 270.31,90.95 S2.6 270.21,102.59 270.21,103.12 264.62,108.71 257.43,108.71 255.7,110.44 SABS1.2
S-D6
  Top 0.305: SLAVE.D6 272.78,102.42 | SABS2.2 261.82,110.72 262.61,109.93 266.5,109.93 272.85,103.58 S2.7
  Top 1.016: 272.78,102.42 S2.7
S-D7
  Top 0.305: SLAVE.D7 275.39,90.95 S2.8 275.39,103.56 269.49,109.45 269.09,109.45 267.87,110.67 SABS3.2
S-D8  (via drill 0.36)
  Top 0.305: S1.1 SLAVE.D8 | v233.49,54.32 232.79,53.61 232.79,50.06 224.77,42.04 205.53,42.04 204.51,41.02 v204.51,38.37
  Bottom 0.305: S1.1 279.36,102.46 279.36,98.82 277.86,97.31 256.71,97.31 254.37,94.97 254.37,88.46 250.28,84.37 241.2,84.37 236.2,79.38 236.2,57.03 v233.49,54.32 | v204.51,38.37 202.99,36.85 186.14,36.85 180.61,31.32 169.18,31.32 166.67,33.83 S-CYT-PPR.2
S-D9  (via drill 0.36)
  Top 0.305: SLAVE.D9 S1.2 278.5,105.92 275.64,105.92 v273.81,107.75
  Bottom 0.305: v273.81,107.75 272.67,108.89 225.96,108.89 223.29,111.56 ODRV-S1.1
S-D10
  Top 0.305: SLAVE.D10 S1.3 284.46,103.48 280.4,107.54 276.35,107.54 STEPPER-S.1
S-D11
  Top 0.305: SLAVE.D11 S1.4 287,103.45 281.37,109.09 277.34,109.09 STEPPER-S.2
S-D12  (via drill 0.36)
  Top 0.305: S1.5 SLAVE.D12 | v304.01,99.21 305.23,99.21 309.35,103.33 SERVO-S.1
  Bottom 0.305: S1.5 289.54,99.96 290.3,99.21 v304.01,99.21
S-D13
  Top 0.305: SLAVE.D13 S1.6 292.08,103.75 291.21,104.62 288.39,104.62 281.69,111.33 281.69,113.59 280.04,115.24 226.95,115.24 225.83,114.12 ODRV-S1.2
S-D22  (via drill 0.36)
  Top 0.305: SLAVE.D22 225.79,89.61 207.52,89.61 S4.3 205.41,89.28 v201.09,89.28 | v180.19,105.11 180.19,98.02 v182.68,95.53 | S-PL.4 158.14,97.41 159.84,99.11 159.84,102.67 167.16,109.98 171.91,109.98 172.87,110.95 S-ENC-1.3
  Bottom 0.305: S-ENC-1.3 172.87,110.54 173.51,109.91 178.13,109.91 180.19,107.85 v180.19,105.11 | v182.68,95.53 183.31,94.89 195.48,94.89 v201.09,89.28
S-D23  (via drill 0.36)
  Top 0.305: SLAVE.D23 208.89,88.35 | 208.89,88.35 S4.4 | v174.29,94.89 172.9,96.29 S-ENC-2.3 172.9,104.55 171.98,103.63 168.35,103.63 163.25,98.53 163.25,97.31 158.27,92.33 S-PL.2 | v199.19,85.06 202.29,85.06 204.44,87.22 206.88,87.22 208,88.35 208.89,88.35
  Bottom 0.305: v174.29,94.89 174.29,92.51 175.62,91.19 175.62,89.94 179.3,86.26 180.7,86.26 184.68,90.25 194.01,90.25 v199.19,85.06
S-D24
  Top 0.305: S4.5 207.01,85.85 208.23,87.07 225.74,87.07 227.01,85.81 SLAVE.D24
S-D25
  Top 0.305: SLAVE.D25 224.47,85.85 S4.6
S-D26  (via drill 0.36)
  Top 0.305: SLAVE.D26 227.01,83.27 225.74,84.53 208.28,84.53 207.06,83.31 S4.7 202.61,83.31 200.59,81.29 v200.59,79.97
  Bottom 0.305: CYT-S.3 171.06,60.2 179.17,68.31 193.08,68.31 200.59,75.82 v200.59,79.97
S-D27
  Top 0.305: SLAVE.D27 224.47,83.31 S4.8
S-D28  (via drill 0.36)
  Top 0.305: S4.9 206.76,80.77 208,82.01 225.78,82.01 SLAVE.D28 | U$12.3 270.05,78.61 269.29,77.85 236.02,77.85 v233.73,80.14
  Bottom 0.305: v233.73,80.14 233.22,80.65 227.14,80.65 SLAVE.D28
S-D29  (via drill 0.36)
  Top 0.305: SLAVE.D29 224.47,80.77 S4.10 | U$13.3 283.86,78.45 281.99,76.58 235.76,76.58 v233.48,78.87
  Bottom 0.305: SLAVE.D29 225.03,80.73 226.29,79.47 232.87,79.47 v233.48,78.87
S-D30
  Top 0.305: ULN-SLAVE.7 185.39,47.9 185.39,65.41 198.24,78.25 206.29,78.25 S4.11 206.71,78.23 207.92,79.45 225.34,79.45 226.6,78.19 SLAVE.D30
S-D31
  Top 0.305: SLAVE.D31 224.47,78.23 S4.12 208.33,78.23 207.04,76.94 200.2,76.94 187.88,64.62 ULN-SLAVE.6
S-D32
  Top 0.305: ULN-SLAVE.5 190.42,64.57 201.55,75.69 S4.13 207.06,75.69 208.28,76.91 225.77,76.91 227.04,75.65 SLAVE.D32
S-D33
  Top 0.305: SLAVE.D33 224.47,75.69 S4.14 208.46,75.69 207.16,74.4 202.9,74.4 192.96,64.47 ULN-SLAVE.4
S-D34
  Top 0.305: ULN-SLAVE.3 195.5,64.49 204.29,73.28 206.17,73.28 S4.15 207.06,73.15 208.28,74.37 225.74,74.37 227.01,73.11 SLAVE.D34
S-D35
  Top 0.305: SLAVE.D35 224.47,73.15 S4.16 208.33,73.15 207.09,71.91 205.31,71.91 197.97,64.57 197.97,47.93 ULN-SLAVE.2
S-D36
  Top 0.305: ULN-SLAVE.1 200.61,47.88 200.61,64.8 206.3,70.49 S4.17 206.93,70.61 208.15,71.83 225.74,71.83 227.01,70.57 SLAVE.D36
S-D37
  Top 0.305: SLAVE.D37 224.47,70.61 S4.18
S-D38  (via drill 0.36)
  Top 0.305: S4.19 206.81,68.07 208.05,69.31 225.78,69.31 SLAVE.D38 | v201.88,99.37 201.88,103.63 206.17,107.92 S-LIM1.1
  Bottom 0.305: v201.88,99.37 203.28,97.97 203.28,71.09 S4.19
S-D39  (via drill 0.36)
  Top 0.305: SLAVE.D39 224.47,68.07 S4.20 | v202.11,96.29 205.79,99.97 205.79,103.89 211.25,109.35 S-LIM1.2
  Bottom 0.305: S4.20 207.57,66.8 204.9,66.8 202.08,69.62 202.08,96.27 v202.11,96.29
S-D40
  Top 0.305: SLAVE.D40 225.78,66.77 208.29,66.77 207.05,65.53 S4.21 204.14,65.53 203.12,64.52 203.12,37.18 212.95,27.35 212.95,21.67 218.74,15.88 S-LIM2.1
S-D41  (via drill 0.36)
  Top 0.305: SLAVE.D41 224.47,65.53 S4.22 | v213.77,39.32 220.65,32.44 220.65,27.1 223.82,23.92 S-LIM2.2
  Bottom 0.305: S4.22 209.47,65.53 210.87,64.13 210.87,42.22 v213.77,39.32
S-D42  (via drill 0.36)
  Top 0.305: S4.23 206.93,62.99 208.23,64.29 214.4,64.29 214.49,64.2 225.81,64.2 SLAVE.D42 | v233.98,58.8 235,57.79 235,55.25 238.3,51.94 BUZ-S.+
  Bottom 0.305: SLAVE.D42 229.84,62.95 v233.98,58.8
S-D43  (via drill 0.36)
  Top 0.305: SLAVE.D43 208.89,62.95 S4.24 | v176.83,61.6 174.73,59.49 162.18,59.49 PARALLEL.7
  Bottom 0.305: v176.83,61.6 176.86,61.62 207.47,61.62 S4.24
S-D44  (via drill 0.36)
  Top 0.305: S4.25 206.93,60.45 208.23,61.75 210.34,61.75 210.43,61.66 225.81,61.66 SLAVE.D44 | v176.83,59.31 174.73,57.2 161.93,57.2 PARALLEL.6
  Bottom 0.305: S4.25 177.98,60.45 v176.83,59.31
S-D45  (via drill 0.36)
  Top 0.305: SLAVE.D45 224.47,60.45 S4.26 | v176.83,57.02 174.73,54.92 161.67,54.92 PARALLEL.5
  Bottom 0.305: S4.26 207.57,59.18 178.99,59.18 v176.83,57.02
S-D46  (via drill 0.36)
  Top 0.305: S4.27 206.68,57.91 207.97,59.21 210.21,59.21 210.3,59.12 225.81,59.12 SLAVE.D46 | v176.89,54.61 174.78,52.5 161.54,52.5 PARALLEL.4
  Bottom 0.305: S4.27 180.19,57.91 v176.89,54.61
S-D47  (via drill 0.36)
  Top 0.305: SLAVE.D47 208.89,57.87 S4.28 | PARALLEL.3 174.8,50.01 176.86,52.07 v176.86,52.15
  Bottom 0.305: v176.86,52.15 177.09,52.15 181.58,56.64 207.57,56.64 S4.28
S-D48  (via drill 0.36)
  Top 0.305: S4.29 206.81,55.37 208.1,56.67 210.34,56.67 210.43,56.58 225.81,56.58 SLAVE.D48 | v176.94,49.53 174.88,47.47 PARALLEL.2
  Bottom 0.305: S4.29 183.16,55.37 177.32,49.53 v176.94,49.53
S-D49  (via drill 0.36)
  Top 0.305: SLAVE.D49 224.47,55.37 S4.30 | v176.94,47.04 176.89,47.04 174.78,44.93 PARALLEL.1
  Bottom 0.305: v176.94,47.04 183.97,54.08 207.54,54.08 S4.30
S-D50  (via drill 0.36)
  Top 0.305: S4.31 206.45,52.83 207.72,54.1 223.46,54.1 223.49,54.07 225.78,54.07 SLAVE.D50 228.48,52.79 229.9,54.2 229.9,93.12 v229.87,93.14
  Bottom 0.305: NRF_SLAVE.6 219.71,97.18 222.78,94.11 228.9,94.11 v229.87,93.14
S-D51  (via drill 0.36)
  Top 0.305: SLAVE.D51 224.47,52.83 S4.32 | v230.43,51.18 231.22,51.97 231.22,65.2 v232.13,66.12
  Bottom 0.305: NRF_SLAVE.7 215.34,100.74 215.34,98.78 221.34,92.79 228.7,92.79 234.75,86.74 234.75,68.73 v232.13,66.12 | v230.43,51.18 230,50.75 228.33,50.75 227.58,51.5 226.55,51.5 225.27,52.79 SLAVE.D51
S-D52  (via drill 0.36)
  Top 0.305: S4.33 207.06,50.29 208.35,51.59 210.34,51.59 210.43,51.5 225.81,51.5 SLAVE.D52 | v182.68,43.23 199.58,43.23 v201.79,45.44
  Bottom 0.305: R1.2 179.78,40.34 v182.68,43.23 | v201.79,45.44 203.28,46.93 203.28,48.54 205.03,50.29 S4.33
S-D53
  Top 0.305: SLAVE.D53 224.47,50.29 S4.34
S-RX0
  Top 0.305: S2.1 257.61,90.95 SLAVE.RX0
  Bottom 0.305: SERIAL.4 244.42,31.24 245.06,31.88 271.07,31.88 272.08,32.89 272.08,56.77 304.34,89.03 304.34,92.58 303.58,93.35 258.62,93.35 257.61,92.33 257.61,90.95 SLAVE.RX0
S-RX1  (via drill 0.36)
  Top 0.305: SLAVE.RX1 240.08,91.21 S3.3 240.08,103.81 238.61,105.28 235.92,105.28 233.6,107.59 222.91,107.59 219.51,111 v219.51,112.62 | S-PL.3 158.27,94.87 161.59,98.2 161.59,101.45 169.06,108.92 174.88,108.92 175.44,108.36 S-ENC-2.2
  Bottom 0.305: S-ENC-2.2 173.23,109.02 169.44,109.02 167.94,110.52 167.94,113.61 170.94,116.61 217.6,116.61 219.48,114.73 219.48,112.65 v219.51,112.62
S-RX2
  Top 0.305: SLAVE.RX2 245.16,91.21 S3.5 245.16,103.51 239.17,109.5 236.17,109.5 233.45,112.22 ODRV-S2.1
S-RX3
  Top 0.305: SLAVE.RX3 250.24,91.21 S3.7 250.24,103.1 243.64,109.7 ODRV-S3.1
S-SCL  (via drill 0.36)
  Top 0.305: S1.10 SLAVE.SCLU | S3.1 235,91.21 SLAVE.SCL | I2C-S1.2 288.11,114.91 294.94,114.91 I2C-S2.2 | v300.76,105.72 300.53,105.94 v290.04,105.94
  Bottom 0.305: S3.1 237.19,104.42 265.91,104.42 266.6,103.74 266.6,101.24 267.28,100.56 268.25,100.56 268.94,101.24 268.94,104.14 270.74,105.94 v290.04,105.94 | I2C-S1.2 285.95,111.58 289.36,108.18 298.35,108.18 300.76,105.77 v300.76,105.72 302.24,104.23 S1.10
S-SDA
  Top 0.305: S1.9 SLAVE.SDAU | S3.2 237.54,91.21 SLAVE.SDA
  Bottom 0.305: I2C-S2.1 292.4,114.91 285.57,114.91 I2C-S1.1 283.41,111.56 287.83,107.14 296.66,107.14 299.25,104.55 | S3.2 237.54,100.81 238.4,99.95 276.07,99.95 277.47,101.34 277.47,103.66 278.36,104.55 299.25,104.55 | 299.25,104.55 299.7,104.09 S1.9
S-TX0
  Top 0.305: S2.2 260.15,90.95 SLAVE.TX0
  Bottom 0.305: SERIAL.3 244.53,28.7 246.18,30.35 271.83,30.35 273.48,32 273.48,56.13 305.61,88.27 305.61,93.35 304.09,94.87 257.86,94.87 255.32,92.33 255.32,89.79 256.84,88.27 258.88,88.27 260.08,89.47 SLAVE.TX0
S-TX1  (via drill 0.36)
  Top 0.305: SLAVE.TX1 242.62,91.21 S3.4 242.62,103.53 239.47,106.68 236.65,106.68 234.26,109.07 223.72,109.07 221.06,111.73 v221.06,112.57 | S-ENC-1.2 172.87,114.73 169.06,114.73 | 169.06,114.73 v167.01,114.73 | 169.06,114.73 157.53,103.2 S-PL.5
  Bottom 0.305: v167.01,114.73 166.24,115.49 166.24,116.99 167.49,118.24 218.29,118.24 221.06,115.47 v221.06,112.57
S-TX2
  Top 0.305: SLAVE.TX2 247.7,91.21 S3.6 247.7,103.28 240.08,110.9 236.98,110.9 235.99,111.89 ODRV-S2.2
S-TX3
  Top 0.305: SLAVE.TX3 252.78,91.21 S3.8 252.78,103.45 246.18,110.06 ODRV-S3.2
S-V1
  Top 1.27: ULN-SLAVE.16 200.58,35.97 210.79,25.76 S-SOLENOID1.2
S-V2
  Top 1.27: ULN-SLAVE.15 198.04,34.95 205.71,27.28 S-SOLENOID1.1
S-V3
  Top 1.27: 195.53,40.13 195.53,33.91 197.82,31.62 S-SOLENOID2.2
  Top 1.524: 195.53,40.13 195.5,40.16 ULN-SLAVE.14
S-V4
  Top 1.27: ULN-SLAVE.13 192.96,14.83 S-SOLENOID2.1
S-V5
  Top 1.27: ULN-SLAVE.12 190.42,30.48 184.76,24.82 S-SOLENOIDS.3
S-V6
  Top 1.27: ULN-SLAVE.11 187.88,32.41 179.68,24.21 S-SOLENOIDS.2
S-V7
  Top 1.27: ULN-SLAVE.10 185.34,35.87 174.6,25.12 S-SOLENOIDS.1
S-VREF
  Top 1.016: SLAVE.IOREF 290.56,34.48 S7.2
SCK
  Bottom 0.305: SHIELD.SCK 64.92,53.42 63.27,55.07 63.27,60.66 64.64,62.03 MASTER.SCK
SCL
  Top 0.305: M6.8 MASTER.SCL 88.67,40.59 87.2,42.06 23.98,42.06 MASTER.SCLU 21.11,30.81 SHIELD.SCL M4.10 21.36,20.22 29.29,12.29 I2C-M1.2 29.29,9.2 28.32,8.23 18.69,8.23 16.84,10.08 I2C-M2.2
SDA
  Top 0.305: M6.7 MASTER.SDA 84.12,41.2 25.65,41.2 MASTER.SDAU 23.65,30.81 SHIELD.SDA M4.9 23.9,20.78 31.83,12.85 I2C-M1.1 31.83,8.64 30.3,7.11 18.14,7.11 17.53,7.72 I2C-M2.1
SRST
  Top 0.305: SLAVE.RST 288.02,34.48 S7.3 288.09,32.39 289.61,30.86 308.71,30.86 310.18,29.39 310.18,25.35 306.98,22.15 RESET.2
TX0
  Top 0.305: MASTER.TX0 63.27,30.81 SHIELD.TX0 63.53,21.16 M5.7
  Bottom 0.305: SERIAL.1 203.28,31.24 188.82,16.79 188.82,11.99 184.28,7.44 111.96,7.44 110.19,9.22 110.19,14.3 101.04,23.44 65.3,23.44 63.78,21.92 M5.7
TX1
  Top 0.305: MASTER.TX1 M6.5 81.05,28.12 90.55,18.62 102.57,18.62 107.72,13.46 107.72,9.58 110.57,6.73 148.11,6.73 149.2,6.73 | ENC-1.2 154.84,9.5 152.07,6.73 149.2,6.73 | M-PL.5 148.26,12.73 150.42,10.57 150.42,7.95 149.2,6.73
TX2
  Top 0.305: MASTER.TX2 M6.3 75.97,26.7 88.93,13.74 91.31,13.74 93.12,11.94 ODRV-M2.2
TX3
  Top 0.305: MASTER.TX3 M6.1 70.89,25.22 83.34,12.78 ODRV-M3.2
VCC
  Top 0.305: 73.1,111.94 74.3,111.94 77.5,115.14
  Top 2.032: ULN-SLAVE.9 181.41,40.23 179.76,41.88 179.76,65.02 168.86,75.92 154.97,75.92 141.94,88.95 ULN-MASTER.9 145.14,85.7 161.14,85.7 167.59,92.15 182.75,92.15 189.1,98.5 189.1,109.73 24V1.2 | PPR-S.1 192.81,91.57 197.76,96.52 PPR-M.3 197.76,113.16 24V1.1
  Top 3.048: P3.3 72.49,110.13 77.5,115.14 89.74,115.14 92.48,112.4 P4.3 92.61,109.12 112.04,109.12 120.27,117.35 188.49,117.35 24V1.2 24V1.1 202.44,117.98 303.43,117.98 316.84,104.57 316.84,22.56 299.75,5.46 270.17,5.46 254.84,20.79 U$3.IN+ 254.84,19.69 24V2.2 24V2.1 | VCC.1 11.38,99.24 15.61,103.47 15.61,109.92 20.93,115.24 28.68,115.24 32.54,111.38 P1.3 32.54,111.81 35.86,115.14 50.72,115.14 52.65,113.21 P2.3 52.65,110.19 57.63,115.16 69.88,115.16 73.1,111.94
  Bottom 2.032: PPR-S.1 192.81,84.35 190.55,82.09 LM358.8
VIN  (via drill 1.04)
  Top 1.016: 44.98,68.56 v44.93,68.61
  Top 1.27: M1.8 MASTER.VIN 48.03,79.07 SHIELD.VIN | SLAVE.VIN 275.39,42.56 S7.8 272.08,31.12 | U$3.OUT+ 279.65,27.1 275.64,31.12 272.08,31.12 | 272.08,31.12 246.68,31.12 236.12,20.55 236.12,9.73 230.35,3.96 14.88,3.96 12.67,6.17 12.67,13.92 9.8,16.79 9.8,41.99 21.49,53.67 36.09,53.67 44.98,62.56 44.98,68.56
  Bottom 1.27: v44.93,68.61 48.29,71.96 SHIELD.VIN
VREF
  Top 0.305: M1.2 MASTER.IOREF 33.05,87.2 SHIELD.VREF

## Text on the board
tNames: S-D10 | S-D11 | GND | GND | GND | S-D5 | GND | S-D6 | GND | S-D7 | PROX1 | PROX3 | PROX4 | S-D51 | S-D53 | S-D2 | GND | VCC | GND | PROX2 | VCC | GND | VCC | GND | VCC | S-D9 | GND | GND | GND | S-D13 | S-RX2 | S-TX2 | S-RX3 | S-TX3 | GND | GND | 5V | 5V | S-SDA | S-SCL | S-SDA | S-SCL | GND | M-V7 | VCC | VCC | GND | M-V1 | M-V2 | M-V3 | M-V4 | M-V5 | M-V6 | S-D12 | 5V | IRQ | S-D50 | S-D4 | S-3.3V | VCC | GND | GND | OUT-M | VCC | S-TX | S-D2 | S-D3 | S-D5 | S-D6 | S-D7 | S-D8 | S-D9 | S-SCL | S-SDA | S-RX1 | S-TX1 | S-RX2 | S-TX2 | S-RX3 | S-TX3 | S-RX | S-D4 | S-D10 | S-D11 | S-D12 | S-D13 | S-SDA | S-SCL | M-V1 | M-V2 | M-V3 | M-V4 | M-V5 | M-V6 | M-V7 | S-AREF | A0 | A1 | A2 | A3 | A5 | RST | 5V | GND | GND | VIN | A4 | A6 | A7 | A8 | A9 | A10 | A11 | A12 | A13 | A14 | A15 | VCC | 5v | 5v | VREF | 3.3V | 22 | 23 | GND | OUT-S | VCC | 24 | 25 | VCC | 26 | 27 | GND | GND | OUT-M | ROBOTICS RESEARCH LAB AND | 28 | 29 | D53 | D52 | INV | OUT-S | D51 | D50 | D36 | D35 | D34 | D33 | D32 | D31 | D30 | GND | PCB POWER MARKET LTD. | N-INV | INV | 30 | 31 | 33 | D49 | D48 | GND | N-INV | 32 | D47 | D46 | 34 | 35 | 36 | 37 | D45 | D44 | 38 | 39 | D43 | D42 | D41 | D40 | 40 | 41 | 42 | 43 | D39 | D38 | S-D43 | D43 | D37 | D36 | S-D44 | 44 | 45 | D34 | D44 | 46 | 47 | D35 | S-D45 | D45 | 48 | D33 | D32 | 49 | D46 | S-D46 | 50 | 51 | D31 | D30 | D47 | S-D47 | GND | D29 | S-D30 | S-D31 | S-D32 | S-D33 | S-D34 | S-D35 | S-D36 | 52 | 53 | D28 | S-D48 | D48 | GND | GND | D27 | D26 | S-D49 | D49 | D25 | D24 | D23 | D22 | S-D26 | 5V | 5V | CYT | PPR | VIN | GND | VCC | S-A15 | S-A14 | S-A13 | S-A12 | S-A11 | S-A10 | S-A9 | S-A8 | S-A7 | S-A6 | S-A5 | S-A4 | S-A3 | S-A2 | S-A1 | S-A0 | GND | GND | S-5V | S-3.3V | S-RST | S-V5 | S-V4 | S-V3 | S-V2 | S-V1 | S-VREF | D9 | S-V7 | S-V6 | SCL | SDA | AREF | GND | D13 | D12 | D11 | D10 | D8 | D7 | D6 | D5 | D4 | D3 | D2 | TX | RX | TX3 | RX3 | TX2 | RX2 | TX1 | RX1 | SDA | SCL | S-D8 | TX0 | S-RX0 | CYT | RX0 | S-TX0 | OUT+ | IN+ | S-V7 | + | A | B | S-V6 | S-V5 | S-V4 | S-V3 | S-V2 | S-V1 | - | GND | GND | D39 | D38 | GND | D41 | D40 | SCL | SDA | 5V | RST | S-RST | 5V | D12 | 5V | GND | GND | TX3 | RX3 | GND | TX2 | RX2 | GND | D13 | D9 | GND | GND | GND | D11 | D10 | D7 | GND | D5 | GND | SCL | D6 | GND | IN- | OUT- | + | A | B | - | SDA | GND | S-D40 | S-D41 | Shreyash Ingale | Robotics Research Lab
bNames: PROX4 | PROX3 | S-D28 | S-D29 | GND | GND | PROX1 | PROX2 | GND | GND | D29 | D28 | ROBOTICS RESEARCH LAB AND | PCB POWER MARKET LTD. | ROBOTICS RESEARCH LAB